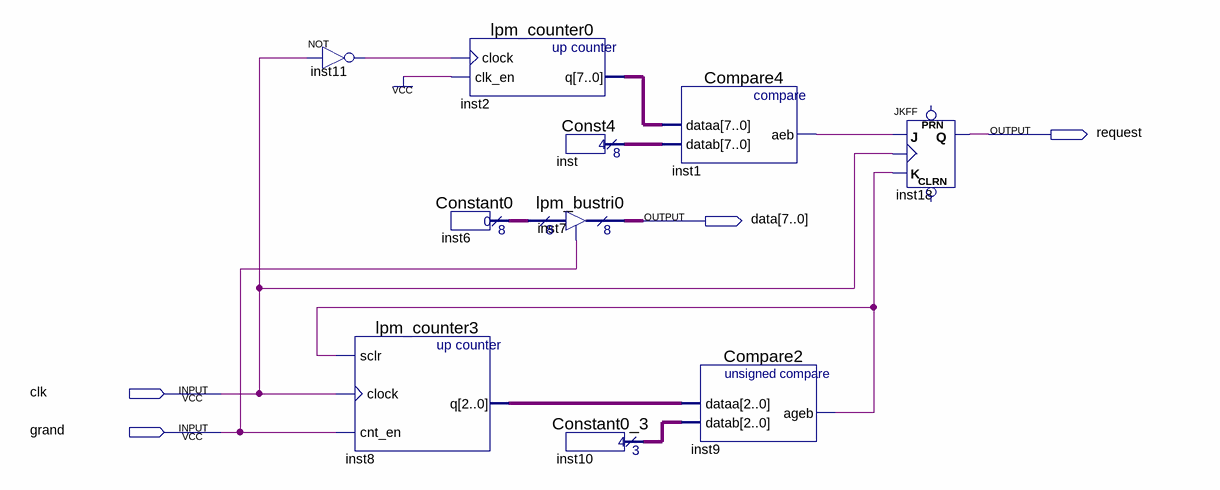
[diagram p0: schematic sheet]
// Quartus schematic Master0.bdf as structural Verilog: 10 symbols, 4 pins
module Master0 (
  input  clk,
  input  grand,
  output request,
  output [7:0] data
);

  wire inst1_aeb, inst9_ageb, inst11_out;
  wire [2:0] inst8_q, inst10_result;
  wire [7:0] inst2_q, inst6_result, inst_result;

  not inst11 (inst11_out, clk);
  lpm_counter3 inst8 (.sclr(inst9_ageb), .clock(clk), .cnt_en(grand), .q(inst8_q));
  Constant0 inst6 (.result(inst6_result));
  lpm_counter0 inst2 (.clock(inst11_out), .clk_en(1'b1), .q(inst2_q));
  Const4 inst (.result(inst_result));
  lpm_bustri0 inst7 (.enabledt(grand), .data(inst6_result), .tridata(data));
  Constant0_3 inst10 (.result(inst10_result));
  Compare4 inst1 (.dataa(inst2_q), .datab(inst_result), .aeb(inst1_aeb));
  Compare2 inst9 (.dataa(inst8_q), .datab(inst10_result), .ageb(inst9_ageb));
  JKFF inst18 (.K(inst9_ageb), .J(inst1_aeb), .CLK(clk), .Q(request));  // open: PRN, CLRN
endmodule
